# Altium schematic sheet Sheet1.SchDoc
size A2
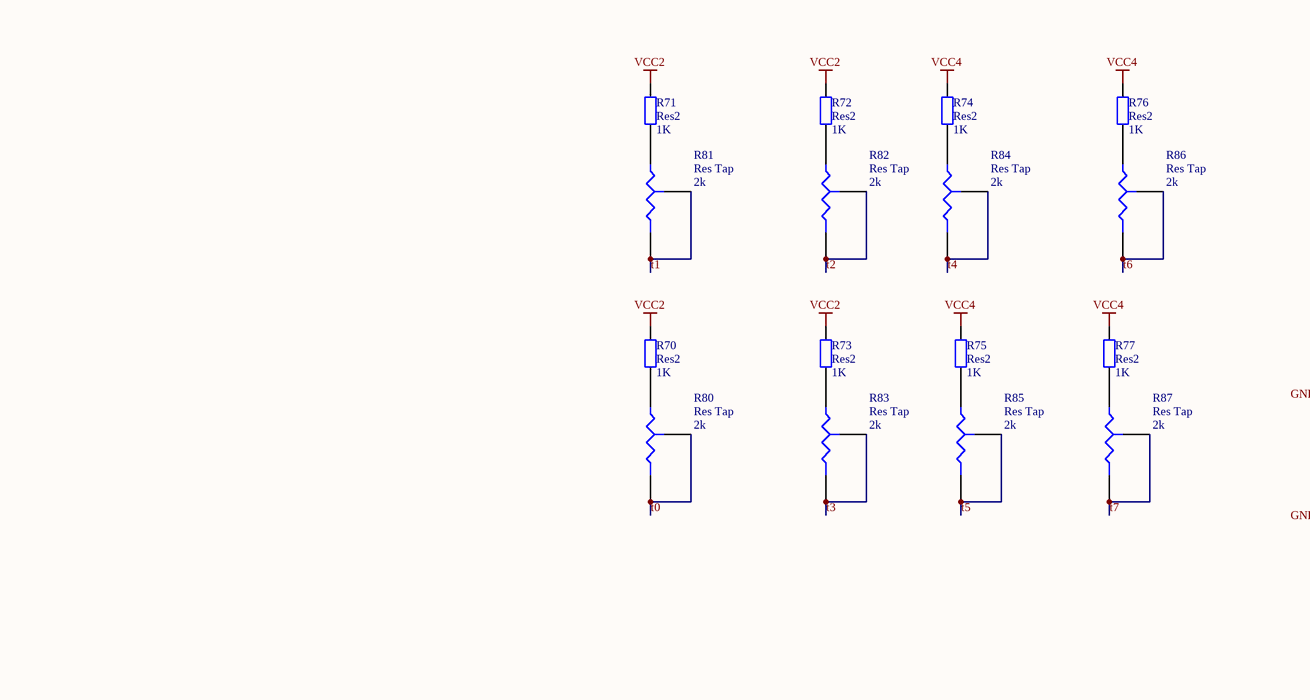
[diagram p0: Sheet1.SchDoc, top left]
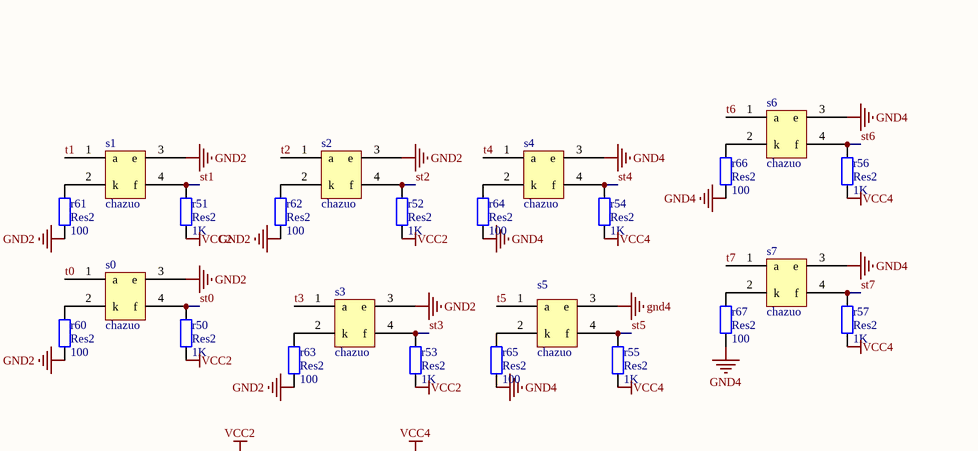
[diagram p1: Sheet1.SchDoc, top right]
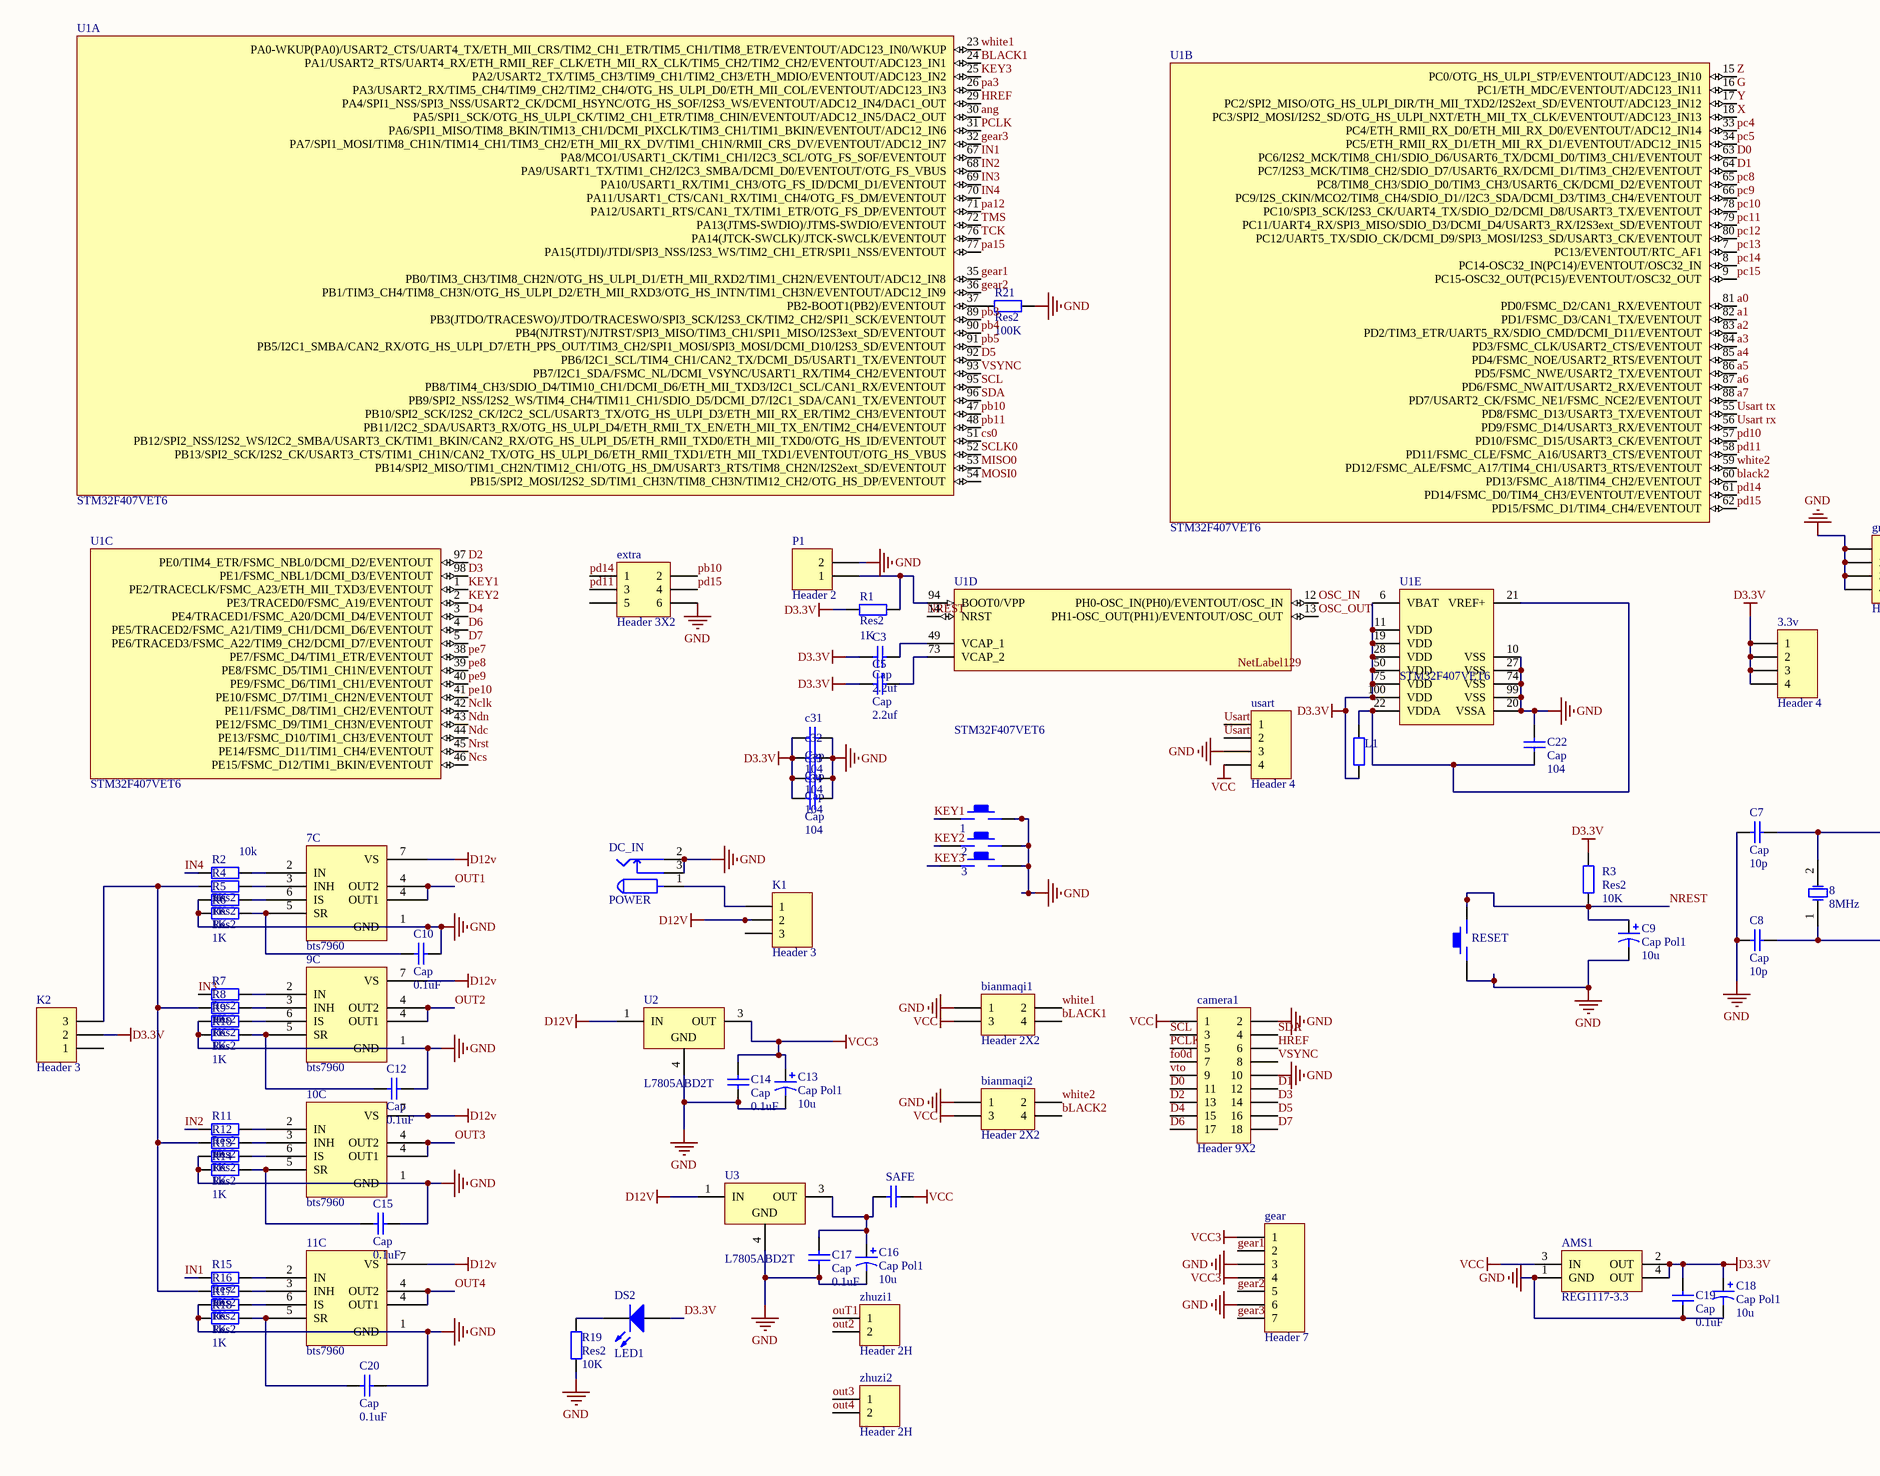
[diagram p2: Sheet1.SchDoc, bottom left]
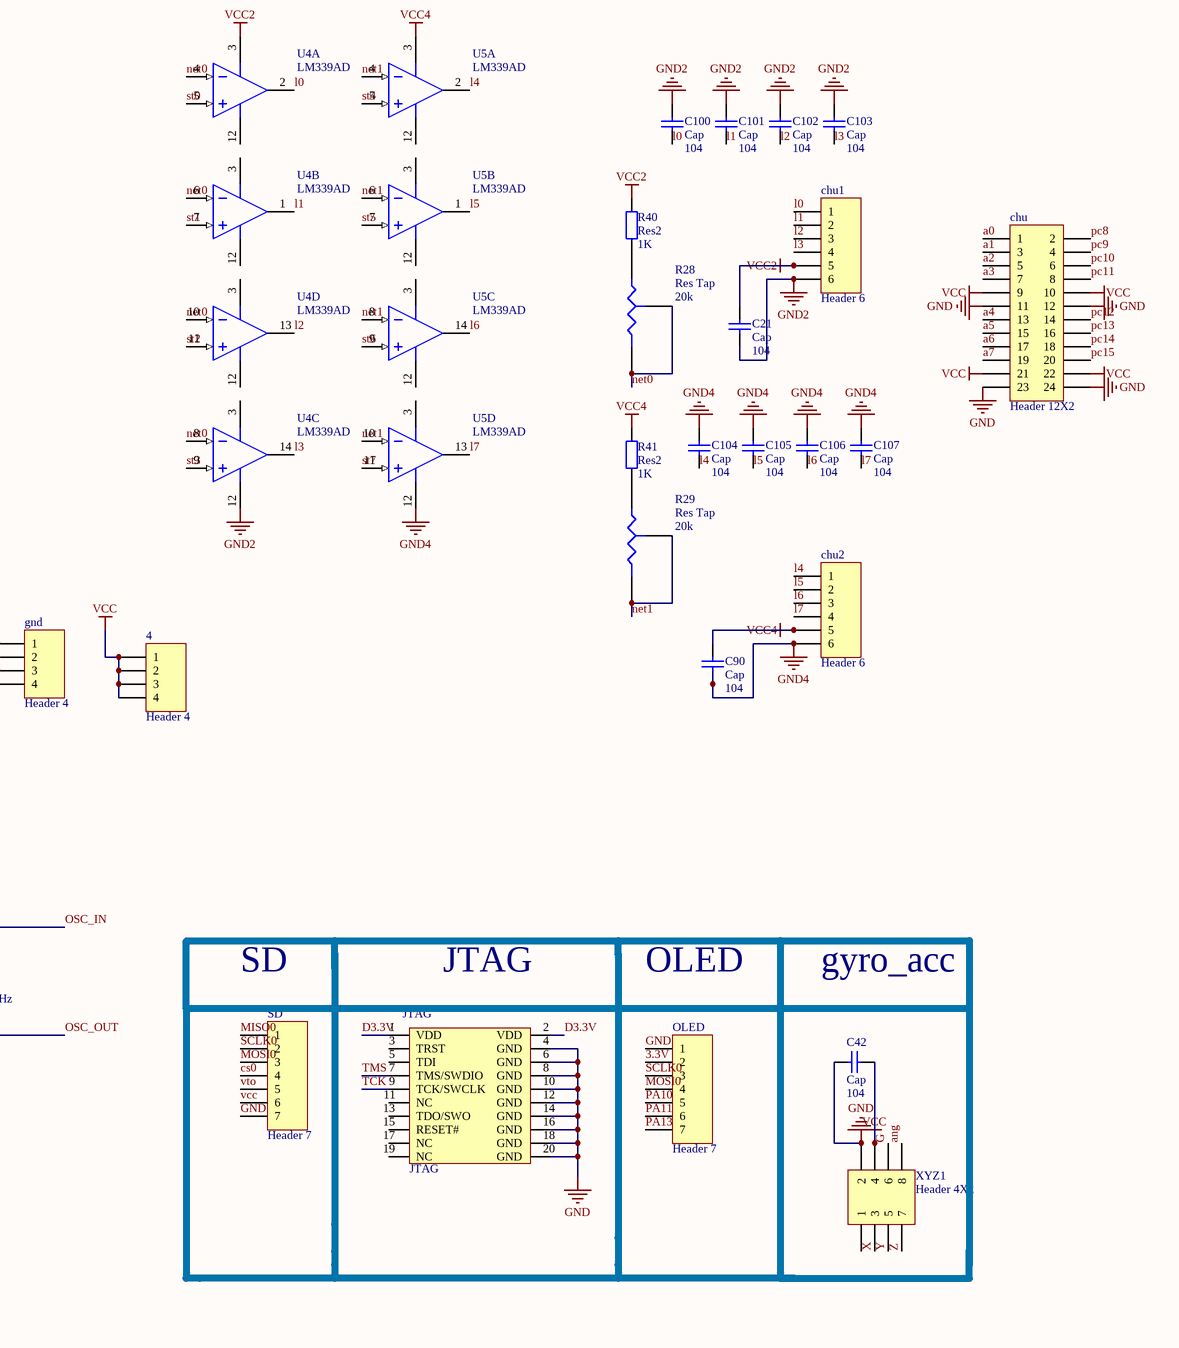
[diagram p3: Sheet1.SchDoc, bottom right]

## Parts
1  KEY_M  [PCBComponent_1 - duplicate3]  (value not drawn)
2  KEY_M  [PCBComponent_1 - duplicate3]  (value not drawn)
3  KEY_M  [PCBComponent_1 - duplicate3]  (value not drawn)
3.3v  Header 4  [HDR1X4]
4  Header 4  [HDR1X4]
7  bts7960  [miaoBTS7960]  (part C of 3)
8  8MHz  [XTAL_US]
9  bts7960  [miaoBTS7960]  (part C of 3)
10  bts7960  [miaoBTS7960]  (part C of 3)
11  bts7960  [miaoBTS7960]  (part C of 3)
AMS1  REG1117-3.3  [ZZ311]
bianmaqi1  Header 2X2  [HDR2X2]
bianmaqi2  Header 2X2  [HDR2X2]
C3  Cap  value 2.2uf  [0805]
C5  Cap  value 2.2uf  [0805]
C7  Cap  value 10p  [0805]
C8  Cap  value 10p  [0805]
C9  Cap Pol1  value 10u  [PCBCom- duplicate]
C10  Cap  value 0.1uF  [0805]
C12  Cap  value 0.1uF  [0805]
C13  Cap Pol1  value 10u  [PCBCom- duplicate]
C14  Cap  value 0.1uF  [0805]
C15  Cap  value 0.1uF  [0805]
C16  Cap Pol1  value 10u  [PCBCom- duplicate]
C17  Cap  value 0.1uF  [0805]
C18  Cap Pol1  value 10u  [PCBCom- duplicate]
C19  Cap  value 0.1uF  [0805]
C20  Cap  value 0.1uF  [0805]
C21  Cap  value 104  [0805]
C22  Cap  value 104  [0805]
c31  Cap  value 104  [0805]
c32  Cap  value 104  [0805]
c33  Cap  value 104  [0805]
c34  Cap  value 104  [0805]
C42  Cap  value 104  [0805]
C90  Cap  value 104  [0805]
C100  Cap  value 104  [0805]
C101  Cap  value 104  [0805]
C102  Cap  value 104  [0805]
C103  Cap  value 104  [0805]
C104  Cap  value 104  [0805]
C105  Cap  value 104  [0805]
C106  Cap  value 104  [0805]
C107  Cap  value 104  [0805]
camera1  Header 9X2  [HDR2X9]
chu  Header 12X2  [HDR2X12]
chu1  Header 6  [HDR1X6]
chu2  Header 6  [HDR1X6]
DC_IN  POWER  [DC10B]
DS2  LED1  [SMDLED]
extra  Header 3X2  [HDR2X3]
gear  Header 7  [HDR1X7]
gnd  Header 4  [HDR1X4]
JTAG  JTAG  [JTAG_20]
K1  Header 3  [HDR1X3]
K2  Header 3  [HDR1X3]
L1  (no value)  [0805]
OLED  Header 7  [HDR1X7]
P1  Header 2  [HDR1X2]
R1  Res2  value 1K  [0805]
R2  10k  value 1K  [0805]
R3  Res2  value 10K  [0805]
R4  Res2  value 1K  [0805]
R5  Res2  value 1K  [0805]
R6  Res2  value 1K  [0805]
R7  Res2  value 1K  [0805]
R8  Res2  value 1K  [0805]
R9  Res2  value 1K  [0805]
R10  Res2  value 1K  [0805]
R11  Res2  value 1K  [0805]
R12  Res2  value 1K  [0805]
R13  Res2  value 1K  [0805]
R14  Res2  value 1K  [0805]
R15  Res2  value 1K  [0805]
R16  Res2  value 1K  [0805]
R17  Res2  value 1K  [0805]
R18  Res2  value 1K  [0805]
R19  Res2  value 10K  [0805]
R21  Res2  value 100K  [0805]
R28  Res Tap  value 20k  [PCBComponent_1 - duplicate2]
R29  Res Tap  value 20k  [PCBComponent_1 - duplicate2]
R40  Res2  value 1K  [0805]
R41  Res2  value 1K  [0805]
r50  Res2  value 1K  [0805]
r51  Res2  value 1K  [0805]
r52  Res2  value 1K  [0805]
r53  Res2  value 1K  [0805]
r54  Res2  value 1K  [0805]
r55  Res2  value 1K  [0805]
r56  Res2  value 1K  [0805]
r57  Res2  value 1K  [0805]
r60  Res2  value 100  [0805]
r61  Res2  value 100  [0805]
r62  Res2  value 100  [0805]
r63  Res2  value 100  [0805]
r64  Res2  value 100  [0805]
r65  Res2  value 100  [0805]
r66  Res2  value 100  [0805]
r67  Res2  value 100  [0805]
R70  Res2  value 1K  [0805]
R71  Res2  value 1K  [0805]
R72  Res2  value 1K  [0805]
R73  Res2  value 1K  [0805]
R74  Res2  value 1K  [0805]
R75  Res2  value 1K  [0805]
R76  Res2  value 1K  [0805]
R77  Res2  value 1K  [0805]
R80  Res Tap  value 2k  [PCBComponent_1 - duplicate2]
R81  Res Tap  value 2k  [PCBComponent_1 - duplicate2]
R82  Res Tap  value 2k  [PCBComponent_1 - duplicate2]
R83  Res Tap  value 2k  [PCBComponent_1 - duplicate2]
R84  Res Tap  value 2k  [PCBComponent_1 - duplicate2]
R85  Res Tap  value 2k  [PCBComponent_1 - duplicate2]
R86  Res Tap  value 2k  [PCBComponent_1 - duplicate2]
R87  Res Tap  value 2k  [PCBComponent_1 - duplicate2]
RESET  KEY_M  [PCBComponent_1 - duplicate3]  (value not drawn)
s0  chazuo  [PCBComponent_1 - duplicate1]
s1  chazuo  [PCBComponent_1 - duplicate1]
s2  chazuo  [PCBComponent_1 - duplicate1]
s3  chazuo  [PCBComponent_1 - duplicate1]
s4  chazuo  [PCBComponent_1 - duplicate1]
s5  chazuo  [PCBComponent_1 - duplicate1]
s6  chazuo  [PCBComponent_1 - duplicate1]
s7  chazuo  [PCBComponent_1 - duplicate1]
SAFE  (no value)  [1812]
SD  Header 7  [HDR1X7]
U1  STM32F407VET6  [LQFP100_V]  (parts A,B,C,D,E of 5)
U2  L7805ABD2T  [TO-263]
U3  L7805ABD2T  [TO-263]
U4  LM339AD  [SO14_N]  (parts A,B,C,D of 4)
U5  LM339AD  [SO14_N]  (parts A,B,C,D of 4)
usart  Header 4  [HDR1X4]
XYZ1  Header 4X2  [HDR2X4]
zhuzi1  Header 2H  [PCBComponent_1 - duplicate]
zhuzi2  Header 2H  [PCBComponent_1 - duplicate]

## Nets
D3.3V: 3.3v.1 3.3v.2 3.3v.3 3.3v.4 AMS1.2(OUT) AMS1.4(OUT) C3.1 C5.1 C18.1 C19.2 c31.2 c32.2 c33.2 c34.2 DS2.1(A) JTAG.1(VDD) JTAG.2(VDD) K2.2 L1.2 R1.1 R3.2 U1.6(VBAT) U1.11(VDD) U1.19(VDD) U1.28(VDD) U1.50(VDD) U1.75(VDD) U1.100(VDD)
D12v: 7.7(VS) 9.7(VS) 10.7(VS) 11.7(VS) K1.2 U2.1(IN) U3.1(IN)
GND: 1.2 2.2 3.2 7.1(GND) 9.1(GND) 10.1(GND) 11.1(GND) AMS1.1(GND) bianmaqi1.1 bianmaqi2.1 C7.2 C8.2 C9.2 C10.1 C12.1 C13.2 C14.1 C15.1 C16.2 C17.1 C18.2 C19.1 C20.1 C22.2 c31.1 c32.1 c33.1 c34.1 C42.2 camera1.2 camera1.10 chu.11 chu.12 chu.23 chu.24 DC_IN.2 DC_IN.3 extra.6 gear.3 gear.6 gnd.1 gnd.2 gnd.3 gnd.4 JTAG.4(GND) JTAG.6(GND) JTAG.8(GND) JTAG.10(GND) JTAG.12(GND) JTAG.14(GND) JTAG.16(GND) JTAG.18(GND) JTAG.20(GND) OLED.1 P1.2 R5.2 R6.2 R9.2 R10.2 R13.2 R14.2 R17.2 R18.2 R19.2 R21.1 RESET.1 SD.7 U1.10(VSS) U1.20(VSSA) U1.27(VSS) U1.74(VSS) U1.99(VSS) U2.4(GND) U3.4(GND) usart.3 XYZ1.2
GND2: C21.1 C100.2 C101.2 C102.2 C103.2 chu1.6 r60.1 r61.1 r62.1 r63.1 s0.3(e) s1.3(e) s2.3(e) s3.3(e) U4.12(V-)
GND4: C90.1 C104.2 C105.2 C106.2 C107.2 chu2.6 r64.1 r65.1 r66.1 r67.1 s4.3(e) s5.3(e) s6.3(e) s7.3(e) U5.12(V-)
vcc: 4.1 4.2 4.3 4.4 AMS1.3(IN) bianmaqi1.3 bianmaqi2.3 C42.1 camera1.1 chu.9 chu.10 chu.21 chu.22 SAFE.1 SD.6 usart.4 XYZ1.4
VCC2: C21.2 chu1.5 R40.1 r50.1 r51.1 r52.1 r53.1 R70.1 R71.1 R72.1 R73.1 U4.3(V+)
VCC3: C13.1 C14.2 gear.1 gear.4 U2.3(OUT)
VCC4: C90.2 chu2.5 R41.1 r54.1 r55.1 r56.1 r57.1 R74.1 R75.1 R76.1 R77.1 U5.3(V+)
3.3V: OLED.2
a0: chu.1 U1.81(PD0/FSMC_D2/CAN1_RX/EVENTOUT)
a1: chu.3 U1.82(PD1/FSMC_D3/CAN1_TX/EVENTOUT)
a2: chu.5 U1.83(PD2/TIM3_ETR/UART5_RX/SDIO_CMD/DCMI_D11/EVENTOUT)
a3: chu.7 U1.84(PD3/FSMC_CLK/USART2_CTS/EVENTOUT)
a4: chu.13 U1.85(PD4/FSMC_NOE/USART2_RTS/EVENTOUT)
a5: chu.15 U1.86(PD5/FSMC_NWE/USART2_TX/EVENTOUT)
a6: chu.17 U1.87(PD6/FSMC_NWAIT/USART2_RX/EVENTOUT)
a7: chu.19 U1.88(PD7/USART2_CK/FSMC_NE1/FSMC_NCE2/EVENTOUT)
ang: U1.30(PA5/SPI1_SCK/OTG_HS_ULPI_CK/TIM2_CH1_ETR/TIM8_CHIN/EVENTOUT/ADC12_IN5/DAC2_OUT) XYZ1.8
BLACK1: bianmaqi1.4 U1.24(PA1/USART2_RTS/UART4_RX/ETH_RMII_REF_CLK/ETH_MII_RX_CLK/TIM5_CH2/TIM2_CH2/EVENTOUT/ADC123_IN1)
black2: bianmaqi2.4 U1.60(PD13/FSMC_A18/TIM4_CH2/EVENTOUT)
cs0: SD.4 U1.51(PB12/SPI2_NSS/I2S2_WS/I2C2_SMBA/USART3_CK/TIM1_BKIN/CAN2_RX/OTG_HS_ULPI_D5/ETH_RMII_TXD0/ETH_MII_TXD0/OTG_HS_ID/EVENTOUT)
D0: camera1.11 U1.63(PC6/I2S2_MCK/TIM8_CH1/SDIO_D6/USART6_TX/DCMI_D0/TIM3_CH1/EVENTOUT)
D1: camera1.12 U1.64(PC7/I2S3_MCK/TIM8_CH2/SDIO_D7/USART6_RX/DCMI_D1/TIM3_CH2/EVENTOUT)
D2: camera1.13 U1.97(PE0/TIM4_ETR/FSMC_NBL0/DCMI_D2/EVENTOUT)
D3: camera1.14 U1.98(PE1/FSMC_NBL1/DCMI_D3/EVENTOUT)
D4: camera1.15 U1.3(PE4/TRACED1/FSMC_A20/DCMI_D4/EVENTOUT)
D5: camera1.16 U1.92(PB6/I2C1_SCL/TIM4_CH1/CAN2_TX/DCMI_D5/USART1_TX/EVENTOUT)
D6: camera1.17 U1.4(PE5/TRACED2/FSMC_A21/TIM9_CH1/DCMI_D6/EVENTOUT)
D7: camera1.18 U1.5(PE6/TRACED3/FSMC_A22/TIM9_CH2/DCMI_D7/EVENTOUT)
fo0d: camera1.7
G: U1.16(PC1/ETH_MDC/EVENTOUT/ADC123_IN11) XYZ1.6
gear1: gear.2 U1.35(PB0/TIM3_CH3/TIM8_CH2N/OTG_HS_ULPI_D1/ETH_MII_RXD2/TIM1_CH2N/EVENTOUT/ADC12_IN8)
gear2: gear.5 U1.36(PB1/TIM3_CH4/TIM8_CH3N/OTG_HS_ULPI_D2/ETH_MII_RXD3/OTG_HS_INTN/TIM1_CH3N/EVENTOUT/ADC12_IN9)
gear3: gear.7 U1.32(PA7/SPI1_MOSI/TIM8_CH1N/TIM14_CH1/TIM3_CH2/ETH_MII_RX_DV/TIM1_CH1N/RMII_CRS_DV/EVENTOUT/ADC12_IN7)
HREF: camera1.6 U1.29(PA4/SPI1_NSS/SPI3_NSS/USART2_CK/DCMI_HSYNC/OTG_HS_SOF/I2S3_WS/EVENTOUT/ADC12_IN4/DAC1_OUT)
IN1: R15.2 U1.67(PA8/MCO1/USART1_CK/TIM1_CH1/I2C3_SCL/OTG_FS_SOF/EVENTOUT)
IN2: R11.2 U1.68(PA9/USART1_TX/TIM1_CH2/I2C3_SMBA/DCMI_D0/EVENTOUT/OTG_FS_VBUS)
IN3: R7.2 U1.69(PA10/USART1_RX/TIM1_CH3/OTG_FS_ID/DCMI_D1/EVENTOUT)
IN4: R2.2 U1.70(PA11/USART1_CTS/CAN1_RX/TIM1_CH4/OTG_FS_DM/EVENTOUT)
KEY1: 1.1 U1.1(PE2/TRACECLK/FSMC_A23/ETH_MII_TXD3/EVENTOUT)
KEY2: 2.1 U1.2(PE3/TRACED0/FSMC_A19/EVENTOUT)
KEY3: 3.1 U1.25(PA2/USART2_TX/TIM5_CH3/TIM9_CH1/TIM2_CH3/ETH_MDIO/EVENTOUT/ADC123_IN2)
l0: C100.1 chu1.1 U4.2(OUT)
l1: C101.1 chu1.2 U4.1(OUT)
l2: C102.1 chu1.3 U4.13(OUT)
l3: C103.1 chu1.4 U4.14(OUT)
l4: C104.1 chu2.1 U5.2(OUT)
l5: C105.1 chu2.2 U5.1(OUT)
l6: C106.1 chu2.3 U5.14(OUT)
l7: C107.1 chu2.4 U5.13(OUT)
MISO0: SD.1 U1.53(PB14/SPI2_MISO/TIM1_CH2N/TIM12_CH1/OTG_HS_DM/USART3_RTS/TIM8_CH2N/I2S2ext_SD/EVENTOUT)
MOSI0: OLED.4 SD.3 U1.54(PB15/SPI2_MOSI/I2S2_SD/TIM1_CH3N/TIM8_CH3N/TIM12_CH2/OTG_HS_DP/EVENTOUT)
Nclk: U1.42(PE11/FSMC_D8/TIM1_CH2/EVENTOUT)
Ncs: U1.46(PE15/FSMC_D12/TIM1_BKIN/EVENTOUT)
Ndc: U1.44(PE13/FSMC_D10/TIM1_CH3/EVENTOUT)
Ndn: U1.43(PE12/FSMC_D9/TIM1_CH3N/EVENTOUT)
net0: R28.2(B) R28.3(TAP) U4.4(IN-) U4.6(IN-) U4.8(IN-) U4.10(IN-)
net1: R29.2(B) R29.3(TAP) U5.4(IN-) U5.6(IN-) U5.8(IN-) U5.10(IN-)
NREST: C9.1 R3.1 RESET.2 U1.14(NRST)
Nrst: U1.45(PE14/FSMC_D11/TIM1_CH4/EVENTOUT)
OSC_IN: 8.2(OSC2) C7.1 U1.12(PH0-OSC_IN(PH0)/EVENTOUT/OSC_IN)
OSC_OUT: 8.1(OSC1) C8.1 U1.13(PH1-OSC_OUT(PH1)/EVENTOUT/OSC_OUT)
OUT1: 7.4(OUT2) zhuzi1.1
OUT2: 9.4(OUT2) zhuzi1.2
OUT3: 10.4(OUT2) zhuzi2.1
OUT4: 11.4(OUT2) zhuzi2.2
pa3: U1.26(PA3/USART2_RX/TIM5_CH4/TIM9_CH2/TIM2_CH4/OTG_HS_ULPI_D0/ETH_MII_COL/EVENTOUT/ADC123_IN3)
PA10: OLED.5
PA11: OLED.6
pa12: U1.71(PA12/USART1_RTS/CAN1_TX/TIM1_ETR/OTG_FS_DP/EVENTOUT)
PA13: OLED.7
pa15: U1.77(PA15(JTDI)/JTDI/SPI3_NSS/I2S3_WS/TIM2_CH1_ETR/SPI1_NSS/EVENTOUT)
pb3: U1.89(PB3(JTDO/TRACESWO)/JTDO/TRACESWO/SPI3_SCK/I2S3_CK/TIM2_CH2/SPI1_SCK/EVENTOUT)
pb4: U1.90(PB4(NJTRST)/NJTRST/SPI3_MISO/TIM3_CH1/SPI1_MISO/I2S3ext_SD/EVENTOUT)
pb5: U1.91(PB5/I2C1_SMBA/CAN2_RX/OTG_HS_ULPI_D7/ETH_PPS_OUT/TIM3_CH2/SPI1_MOSI/SPI3_MOSI/DCMI_D10/I2S3_SD/EVENTOUT)
pb10: extra.2 U1.47(PB10/SPI2_SCK/I2S2_CK/I2C2_SCL/USART3_TX/OTG_HS_ULPI_D3/ETH_MII_RX_ER/TIM2_CH3/EVENTOUT)
pb11: U1.48(PB11/I2C2_SDA/USART3_RX/OTG_HS_ULPI_D4/ETH_RMII_TX_EN/ETH_MII_TX_EN/TIM2_CH4/EVENTOUT)
pc4: U1.33(PC4/ETH_RMII_RX_D0/ETH_MII_RX_D0/EVENTOUT/ADC12_IN14)
pc5: U1.34(PC5/ETH_RMII_RX_D1/ETH_MII_RX_D1/EVENTOUT/ADC12_IN15)
pc8: chu.2 U1.65(PC8/TIM8_CH3/SDIO_D0/TIM3_CH3/USART6_CK/DCMI_D2/EVENTOUT)
pc9: chu.4 U1.66(PC9/I2S_CKIN/MCO2/TIM8_CH4/SDIO_D1//I2C3_SDA/DCMI_D3/TIM3_CH4/EVENTOUT)
pc10: chu.6 U1.78(PC10/SPI3_SCK/I2S3_CK/UART4_TX/SDIO_D2/DCMI_D8/USART3_TX/EVENTOUT)
pc11: chu.8 U1.79(PC11/UART4_RX/SPI3_MISO/SDIO_D3/DCMI_D4/USART3_RX/I2S3ext_SD/EVENTOUT)
pc12: chu.14 U1.80(PC12/UART5_TX/SDIO_CK/DCMI_D9/SPI3_MOSI/I2S3_SD/USART3_CK/EVENTOUT)
pc13: chu.16 U1.7(PC13/EVENTOUT/RTC_AF1)
pc14: chu.18 U1.8(PC14-OSC32_IN(PC14)/EVENTOUT/OSC32_IN)
pc15: chu.20 U1.9(PC15-OSC32_OUT(PC15)/EVENTOUT/OSC32_OUT)
PCLK: camera1.5 U1.31(PA6/SPI1_MISO/TIM8_BKIN/TIM13_CH1/DCMI_PIXCLK/TIM3_CH1/TIM1_BKIN/EVENTOUT/ADC12_IN6)
pd10: U1.57(PD10/FSMC_D15/USART3_CK/EVENTOUT)
pd11: extra.3 U1.58(PD11/FSMC_CLE/FSMC_A16/USART3_CTS/EVENTOUT)
pd14: extra.1 U1.61(PD14/FSMC_D0/TIM4_CH3/EVENTOUT/EVENTOUT)
pd15: extra.4 U1.62(PD15/FSMC_D1/TIM4_CH4/EVENTOUT)
pe7: U1.38(PE7/FSMC_D4/TIM1_ETR/EVENTOUT)
pe8: U1.39(PE8/FSMC_D5/TIM1_CH1N/EVENTOUT)
pe9: U1.40(PE9/FSMC_D6/TIM1_CH1/EVENTOUT)
pe10: U1.41(PE10/FSMC_D7/TIM1_CH2N/EVENTOUT)
SCL: camera1.3 U1.95(PB8/TIM4_CH3/SDIO_D4/TIM10_CH1/DCMI_D6/ETH_MII_TXD3/I2C1_SCL/CAN1_RX/EVENTOUT)
SCLK0: OLED.3 SD.2 U1.52(PB13/SPI2_SCK/I2S2_CK/USART3_CTS/TIM1_CH1N/CAN2_TX/OTG_HS_ULPI_D6/ETH_RMII_TXD1/ETH_MII_TXD1/EVENTOUT/OTG_HS_VBUS)
SDA: camera1.4 U1.96(PB9/SPI2_NSS/I2S2_WS/TIM4_CH4/TIM11_CH1/SDIO_D5/DCMI_D7/I2C1_SDA/CAN1_TX/EVENTOUT)
st0: r50.2 s0.4(f) U4.5(IN+)
st1: r51.2 s1.4(f) U4.7(IN+)
st2: r52.2 s2.4(f) U4.11(IN+)
st3: r53.2 s3.4(f) U4.9(IN+)
st4: r54.2 s4.4(f) U5.5(IN+)
st5: r55.2 s5.4(f) U5.7(IN+)
st6: r56.2 s6.4(f) U5.9(IN+)
st7: r57.2 s7.4(f) U5.11(IN+)
t0: R80.2(B) R80.3(TAP) s0.1(a)
t1: R81.2(B) R81.3(TAP) s1.1(a)
t2: R82.2(B) R82.3(TAP) s2.1(a)
t3: R83.2(B) R83.3(TAP) s3.1(a)
t4: R84.2(B) R84.3(TAP) s4.1(a)
t5: R85.2(B) R85.3(TAP) s5.1(a)
t6: R86.2(B) R86.3(TAP) s6.1(a)
t7: R87.2(B) R87.3(TAP) s7.1(a)
TCK: JTAG.9(TCK/SWCLK) U1.76(PA14(JTCK-SWCLK)/JTCK-SWCLK/EVENTOUT)
TMS: JTAG.7(TMS/SWDIO) U1.72(PA13(JTMS-SWDIO)/JTMS-SWDIO/EVENTOUT)
Usart rx: U1.56(PD9/FSMC_D14/USART3_RX/EVENTOUT) usart.2
Usart tx: U1.55(PD8/FSMC_D13/USART3_TX/EVENTOUT) usart.1
VSYNC: camera1.8 U1.93(PB7/I2C1_SDA/FSMC_NL/DCMI_VSYNC/USART1_RX/TIM4_CH2/EVENTOUT)
vto: camera1.9 SD.5
white1: bianmaqi1.2 U1.23(PA0-WKUP(PA0)/USART2_CTS/UART4_TX/ETH_MII_CRS/TIM2_CH1_ETR/TIM5_CH1/TIM8_ETR/EVENTOUT/ADC123_IN0/WKUP)
white2: bianmaqi2.2 U1.59(PD12/FSMC_ALE/FSMC_A17/TIM4_CH1/USART3_RTS/EVENTOUT)
X: U1.18(PC3/SPI2_MOSI/I2S2_SD/OTG_HS_ULPI_NXT/ETH_MII_TX_CLK/EVENTOUT/ADC123_IN13) XYZ1.3
Y: U1.17(PC2/SPI2_MISO/OTG_HS_ULPI_DIR/TH_MII_TXD2/I2S2ext_SD/EVENTOUT/ADC123_IN12) XYZ1.5
Z: U1.15(PC0/OTG_HS_ULPI_STP/EVENTOUT/ADC123_IN10) XYZ1.7
Net7_2: 7.2(IN) R2.1
Net7_3: 7.3(INH) R4.1
Net7_5: 7.5(SR) C10.2 R6.1
Net7_6: 7.6(IS) R5.1
Net9_2: 9.2(IN) R7.1
Net9_3: 9.3(INH) R8.1
Net9_5: 9.5(SR) C12.2 R10.1
Net9_6: 9.6(IS) R9.1
Net10_2: 10.2(IN) R11.1
Net10_3: 10.3(INH) R12.1
Net10_5: 10.5(SR) C15.2 R14.1
Net10_6: 10.6(IS) R13.1
Net11_2: 11.2(IN) R15.1
Net11_3: 11.3(INH) R16.1
Net11_5: 11.5(SR) C20.2 R18.1
Net11_6: 11.6(IS) R17.1
NetC3_2: C3.2 U1.49(VCAP_1)
NetC5_2: C5.2 U1.73(VCAP_2)
NetC16_1: C16.1 C17.2 SAFE.2 U3.3(OUT)
NetC22_1: C22.1 L1.1 U1.21(VREF+) U1.22(VDDA)
NetDC_IN_1: DC_IN.1 K1.1
NetDS2_2: DS2.2(K) R19.1
NetK2_3: K2.3 R4.2 R8.2 R12.2 R16.2
NetP1_1: P1.1 R1.2 U1.94(BOOT0/VPP)
NetR21_2: R21.2 U1.37(PB2-BOOT1(PB2)/EVENTOUT)
NetR28_1: R28.1(A) R40.2
NetR29_1: R29.1(A) R41.2
Netr60_2: r60.2 s0.2(k)
Netr61_2: r61.2 s1.2(k)
Netr62_2: r62.2 s2.2(k)
Netr63_2: r63.2 s3.2(k)
Netr64_2: r64.2 s4.2(k)
Netr65_2: r65.2 s5.2(k)
Netr66_2: r66.2 s6.2(k)
Netr67_2: r67.2 s7.2(k)
NetR70_2: R70.2 R80.1(A)
NetR71_2: R71.2 R81.1(A)
NetR72_2: R72.2 R82.1(A)
NetR73_2: R73.2 R83.1(A)
NetR74_2: R74.2 R84.1(A)
NetR75_2: R75.2 R85.1(A)
NetR76_2: R76.2 R86.1(A)
NetR77_2: R77.2 R87.1(A)

Not connected (* = marked no-connect by the designer): extra 5; JTAG 3(TRST) 5(TDI) 11(NC) 13(TDO/SWO) 15(RESET#) 17(NC) 19(NC); K1 3; K2 1; XYZ1 1

## Notes on the sheet
- SD
- JTAG
- OLED
- gyro_acc
- Labels drawn without touching a wire or pin: NetLabel129

## Library data of the parts
3.3v 4 gnd usart = Header 4: Header, 4-Pin; LatestRevisionDate: 17-Jul-2002; LatestRevisionNote: Re-released for DXP Platform.; Publisher: Altium Limited
8 = XTAL: Crystal Oscillator; Published: 8-Jun-2000; LatestRevisionDate: 17-Jul-2002; LatestRevisionNote: Re-released for DXP Platform.; Publisher: Altium Limited
AMS1 = REG1117-3.3: 800mA and 1A Low Dropout Positive Regulator 2.85V, 3.3V, 5V, and Adjustable; Published: 8-Jun-2000; LatestRevisionDate: 17-Jul-2002; LatestRevisionNote: Re-released for DXP Platform.; DatasheetVersion: Sep-1997; PackageVersion: revC; PackageReference: ZZ311; Publisher: Altium Limited; PackageDescription: SOT-223/SC-73; 4 Leads; Body 6.7 x 7.3 mm, inc. leads (LxW max); ComponentLink1Description: Manufacturer Link; ComponentLink1URL: http://www.ti.com/; ComponentLink2Description: Datasheet; ComponentLink2URL: http://www-s.ti.com/sc/ds/REG1117.pdf
bianmaqi1 bianmaqi2 = Header 2X2: Header, 2-Pin, Dual row; LatestRevisionDate: 17-Jul-2002; LatestRevisionNote: Re-released for DXP Platform.; Publisher: Altium Limited
C3 C5 C7 C8 C10 C12 C14 C15 C17 C19-C22 c31-c34 C42 C90 C100-C107 SAFE = Cap: Capacitor; Published: 8-Jun-2000; LatestRevisionDate: 17-Jul-2002; LatestRevisionNote: Re-released for DXP Platform.; PackageReference: RAD-0.3; Publisher: Altium Limited
C9 C13 C16 C18 = Cap Pol1: Polarized Capacitor (Radial); Published: 8-Jun-2000; LatestRevisionDate: 17-Jul-2002; LatestRevisionNote: Re-released for DXP Platform.; PackageReference: RB7.6-15; Publisher: Altium Limited
camera1 = Header 9X2: Header, 9-Pin, Dual row; LatestRevisionDate: 17-Jul-2002; LatestRevisionNote: Re-released for DXP Platform.; Publisher: Altium Limited
chu = Header 12X2: Header, 12-Pin, Dual row; LatestRevisionDate: 17-Jul-2002; LatestRevisionNote: Re-released for DXP Platform.; Publisher: Altium Limited
chu1 chu2 = Header 6: Header, 6-Pin; LatestRevisionDate: 17-Jul-2002; LatestRevisionNote: Re-released for DXP Platform.; Publisher: Altium Limited
DC_IN = POW
DS2 = LED2: Typical RED, GREEN, YELLOW, AMBER GaAs LED; Published: 8-Jun-2000; LatestRevisionDate: 17-Jul-2002; LatestRevisionNote: Re-released for DXP Platform.; PackageDocument: Feb-2002; PackageReference: 3.2X1.6X1.1; Publisher: Altium Limited
extra = Header 3X2: Header, 3-Pin, Dual row; LatestRevisionDate: 17-Jul-2002; LatestRevisionNote: Re-released for DXP Platform.; Publisher: Altium Limited
gear OLED SD = Header 7: Header, 7-Pin; LatestRevisionNote: Re-released for DXP Platform.; Publisher: Altium Limited
  gear OLED: LatestRevisionDate: 17-Jul-2002
  SD: LatestRevisionDate: SD
K1 K2 = Header 3: Header, 3-Pin; LatestRevisionDate: 17-Jul-2002; LatestRevisionNote: Re-released for DXP Platform.; Publisher: Altium Limited
L1 R1-R19 R21 R40 R41 r50-r57 r60-r67 R70-R77 = Res2: Resistor; Published: 8-Jun-2000; LatestRevisionDate: 17-Jul-2002; LatestRevisionNote: Re-released for DXP Platform.; PackageReference: AXIAL-0.4; Publisher: Altium Limited
P1 = Header 2: Header, 2-Pin; LatestRevisionDate: 17-Jul-2002; LatestRevisionNote: Re-released for DXP Platform.; Publisher: Altium Limited
R28 R29 R80-R87 = Res Tap: Tapped Resistor; Sim Note: Enter the Resistance value and the set point into parameter fields.; Set Position: 0.5; Published: 24-Mar-1999; LatestRevisionDate: 17-Jul-2002; LatestRevisionNote: Re-released for DXP Platform.; PackageReference: VR3; Publisher: Altium Limited
U1 = STM32F407VET6: ARM Cortex-M4 32b MCU+FPU, 210DMIP, 512 kB Flash, 192+4 kB RAM, Camera, 82 I/Os, 100-pin LQFP, -40 to +85°C, Tray; Internal RAM: 192kB; Operating Frequency (Processor Speed): 168MHz; A/D Converter: 16x12-bit; D/A Converter: 2x12-bit; 16-bit Timers (IC/OC/PWM): 12x16-bit(24/24/30); 32-bit Timer (IC/OC/PWM): 2x32-bit (8/8/8); Other Timer Functions: 2xWDG, RTC, 24-bit down counter; Serial Interface: 3xSPI/2xI2S/2xI2C/3xUSART(IrDa, ISO7816)/3xUART/2xUSB OTG FS/HS, 2xCAN/Ethernet MAC10/100, SDIO; DatasheetVersion: rev2, Jan-2012; PackageVersion: 2012; PackageReference: LQFP100; PackageDescription: 100-Pin Low Profile Quad Flat Package, 14x14 mm Body, 0.5 mm Pitch; ComponentLink1Description: Manufacturer URL; ComponentLink1URL: http://www.st.com/; ComponentLink2Description: STM32F405/7 Datasheet; ComponentLink2URL: http://www.st.com/internet/com/TECHNICAL_RESOURCES/TECHNICAL_LITERATURE/DATASHEET/DM00037051.pdf; ComponentLink3Description: STM32F4 Web Page; ComponentLink3URL: http://www.st.com/internet/mcu/subclass/1521.jsp
U2 U3 = L7805ABD2T: Precision 1A Regulator; Published: 24-Aug-2001; LatestRevisionDate: 17-Jul-2002; LatestRevisionNote: Re-released for DXP Platform.; DatasheetVersion: Nov-1999; PackageReference: TO-263; Publisher: Altium Limited; PackageDescription: D2-PAK/TO-263-AB; 3 Leads (1 Cropped); Body 15.9 (inc. leads) x 10.4 mm (LxW max); ComponentLink1Description: Manufacturer Link; ComponentLink1URL: http://www.st.com/; ComponentLink2Description: Datasheet; ComponentLink2URL: http://www.st.com/stonline/products/literature/ds/2144/l7805ab.pdf
U4 U5 = LM339AD: Low-Power Quad Voltage Comparator; Published: 24-Aug-2001; LatestRevisionDate: 13-Apr-2006; LatestRevisionNote: IPC-7351 Footprint Added.; DatasheetVersion: Jun-1998; PackageVersion: Sep-1998; PackageReference: SO14; Publisher: Altium Limited; PackageDescription: 14-Pin Small Outline Integrated Circuit 1.27 mm Pitch; Code_IPC: SOIC127P600-14; ComponentLink1Description: Manufacturer Link; ComponentLink1URL: http://www.st.com/; ComponentLink2Description: Datasheet; ComponentLink2URL: http://www.st.com/stonline/products/literature/ds/2159/lm239.pdf
XYZ1 = Header 4X2: Header, 4-Pin, Dual row; LatestRevisionDate: 17-Jul-2002; LatestRevisionNote: Re-released for DXP Platform.; Publisher: Altium Limited
zhuzi1 zhuzi2 = Header 2H: Header, 2-Pin, Right Angle; LatestRevisionDate: 17-Jul-2002; LatestRevisionNote: Re-released for DXP Platform.; Publisher: Altium Limited